# EAGLE design sklpf (EAGLE 7.7.0)
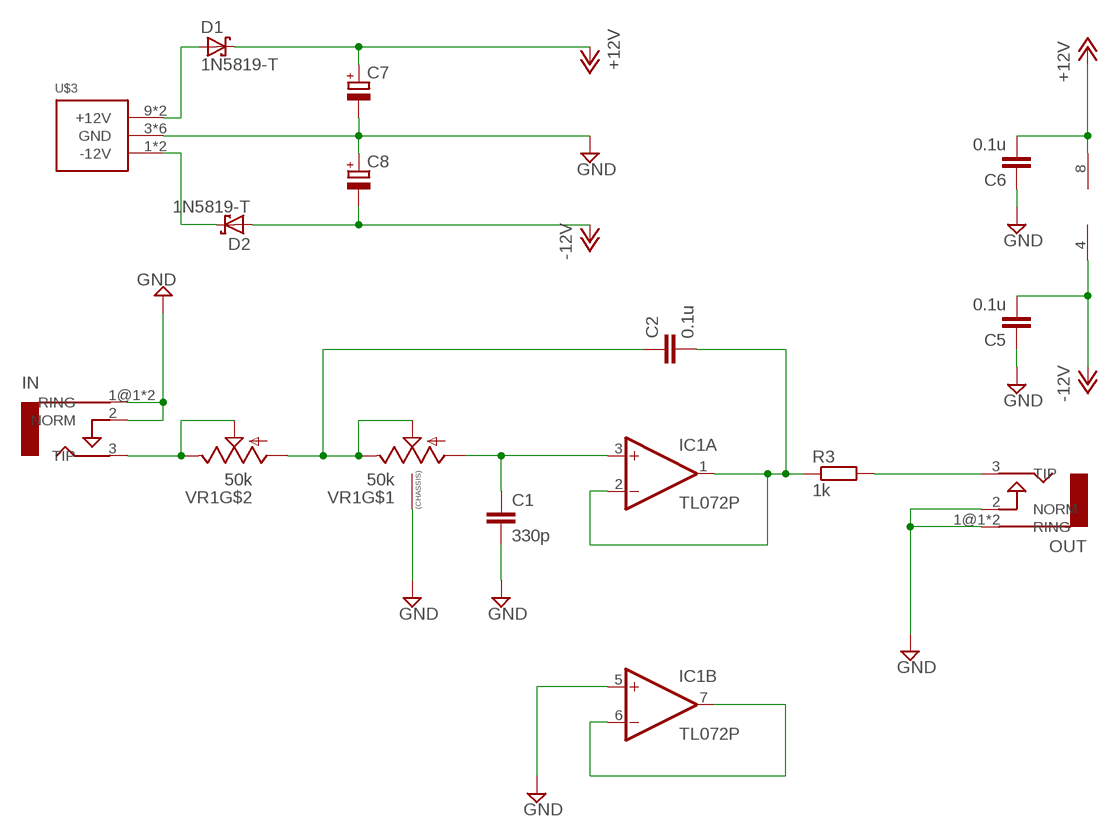
[diagram p0: schematic, sheet 1]

## Parts
C1  330p  C-EU025-025X050  [C025-025X050]
C2  0.1u  C-EU050-025X075  [C050-025X075]
C5  0.1u  C-EU025-025X050  [C025-025X050]
C6  0.1u  C-EU025-025X050  [C025-025X050]
C7  CPOL-EUE2,5-6E  [E2,5-6E]
C8  CPOL-EUE2,5-6E  [E2,5-6E]
D1  1N5819-T  [DO41-7.6]
D2  1N5819-T  [DO41-7.6]
IC1  TL072P  [DIL08]
IN  AUDIO-JACKERTHENVAR  [ERTHENVAR-JACK]
OUT  AUDIO-JACKERTHENVAR  [ERTHENVAR-JACK]
R3  1k  R-EU_0207/2V  [0207/2V]
U$3  POWER_SIMPLE10  [POWER_10]
VR1  50k  ALPHA-9MM-DUALPOT  [DUAL_9MM_SNAP-IN_POT]

## Nets
+12V: C6.2 C7.+ D1.C IC1.8(P:V+)
-12V: C5.2 C8.- D2.A IC1.4(P:V-)
GND: C1.2 C5.1 C6.1 C7.- C8.+ IC1.5(B:+IN) IN.1@1(RING) IN.1@2(RING) IN.2(NORM) OUT.1@1(RING) OUT.1@2(RING) OUT.2(NORM) U$3.3(GND) U$3.4(GND) U$3.5(GND) U$3.6(GND) U$3.7(GND) U$3.8(GND) VR1.CHASSIS1 VR1.CHASSIS2
N$1: C2.2 IC1.1(A:OUT) IC1.2(A:-IN) R3.1
N$2: C1.1 IC1.3(A:+IN) VR1.1(A)
N$3: C2.1 VR1.1B(A) VR1.2(S) VR1.3(E)
N$4: IN.3(TIP) VR1.2B(S) VR1.3B(E)
N$5: IC1.6(B:-IN) IC1.7(B:OUT)
N$6: OUT.3(TIP) R3.2
N$9: D2.C U$3.1(-12V) U$3.2(-12V)
N$10: D1.A U$3.9(+12V) U$3.10(+12V)

## Library data of the parts
C1 C2 C5 C6 = rcl:C-EU: CAPACITOR, European symbol
C7 C8 = rcl:CPOL-EU: POLARIZED CAPACITOR, European symbol
D1 D2 = diode:1N581*: 1.0A SCHOTTKY BARRIER RECTIFIER Source: http://www.diodes.com/datasheets/ds23001.pdf
IC1 = linear:TL072: OP AMP
IN OUT = erthenvar:AUDIO-JACK: Switching Mono 3.5mm Audio Jack from Erthenvar.
R3 = rcl:R-EU_: RESISTOR, European symbol
U$3 = eurorack:POWER_SIMPLE
VR1 = MusicThingModular:ALPHA-9MM-DUALPOT: 9mm vertical snap-in pot, Alpha / Panasonic style, with a connection to the metal chassis for grounding

## Board
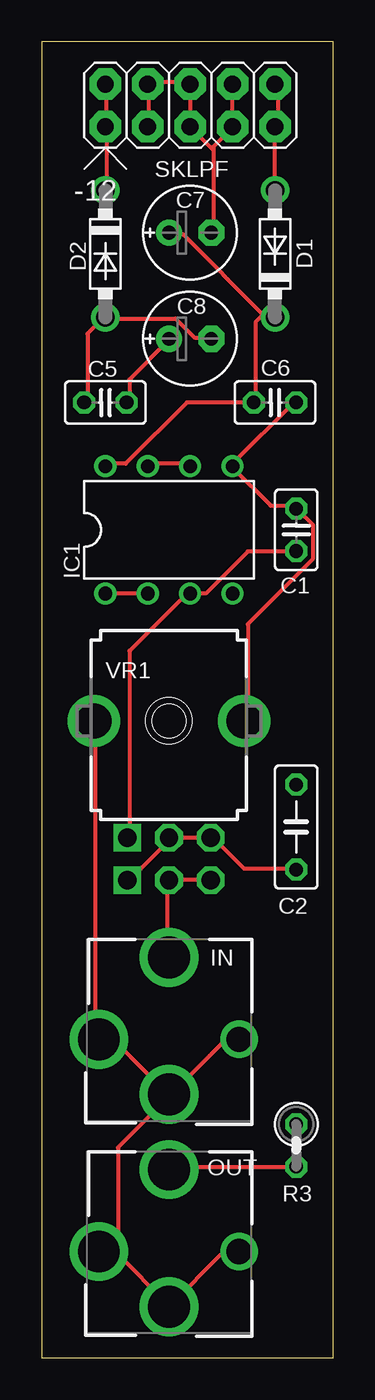
[diagram p1: board, top side]
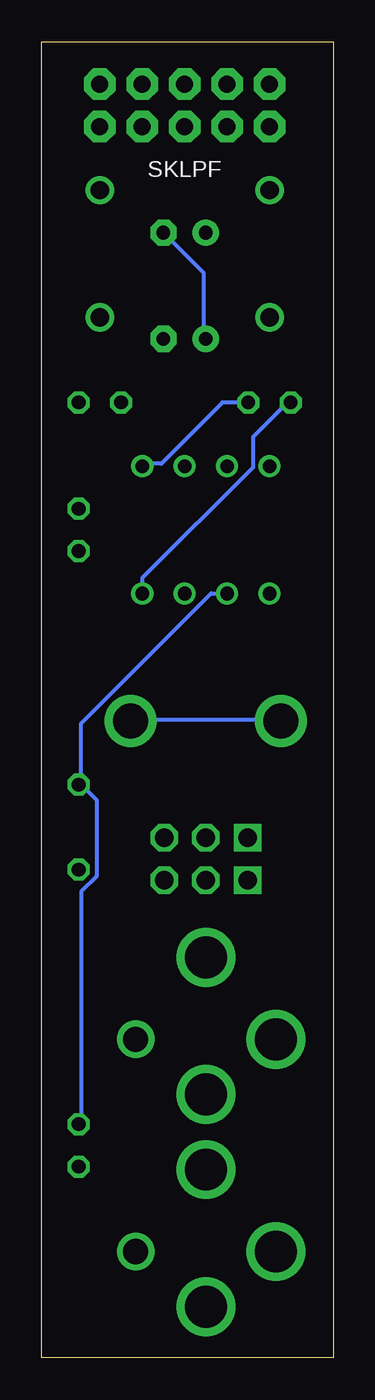
[diagram p2: board, bottom side, seen from below]

Size 17.45 x 78.73 mm. Coordinates in mm from the lower left corner, seen from the top.
Outline: 0,0 17.45,0 17.45,78.73 0,78.73 0,0
Copper layers (1*16): Top 0.035mm / dielectric 1.5mm / Bottom 0.035mm
Design rules "default": minimum track width 10mil, minimum drill 24mil, track to track 8mil, track to pad 8mil, pad to pad 8mil, via to via 8mil, smd to smd 8mil, copper to edge 40mil, drill to drill 8mil, minimum pad ring 10mil, minimum via ring 8mil, stop-mask expansion 4mil, vias tented up to drill 0mil, thermal gap 10mil

### Footprints (pad centres in the part's own frame; a part is rotated, then mirrored left to right if it is on the bottom)
C025-025X050 = drill 0.813 octagon: 1 -1.27,0; 2 1.27,0
C050-025X075 = drill 0.813 octagon: 1 -2.54,0; 2 2.54,0
E2,5-6E = drill 0.813 pad 1.575: + -1.27,0 | drill 0.813 pad 1.575 octagon: - 1.27,0
DO41-7.6 = drill 1.1 pad 1.7: A 3.81,0; C -3.81,0
DIL08 = drill 0.813 pad 1.27: 1 -3.81,-3.81; 2 -1.27,-3.81; 3 1.27,-3.81; 4 3.81,-3.81; 5 3.81,3.81; 6 1.27,3.81; 7 -1.27,3.81; 8 -3.81,3.81
ERTHENVAR-JACK = drill 2.5: 1@1 -4.2,0; 2 0,-3.3; 3 0,4.9 | drill 1.5: 1@2 4.2,0
0207/2V = drill 0.813 octagon: 1 -1.27,0; 2 1.27,0
POWER_10 = drill 1.016 pad 1.88 octagon: 1 -5.08,-1.27; 2 -5.08,1.27; 3 -2.54,-1.27; 4 -2.54,1.27; 5 0,-1.27; 6 0,1.27; 7 2.54,-1.27; 8 2.54,1.27; 9 5.08,-1.27; 10 5.08,1.27
DUAL_9MM_SNAP-IN_POT = drill 1.1 square: 1 -2.5,-7; 1B -2.5,-9.54 | drill 1.1 octagon: 2 0,-7; 2B 0,-9.54; 3 2.5,-7; 3B 2.5,-9.54 | drill 2.1 pad 2.54: CHASSIS1 -4.5,0; CHASSIS2 4.5,0

### Placement (x,y rotation side)
C1  15.24,49.53 90 top
C2  15.24,31.75 90 top
C5  3.81,57.15 180 top
C6  13.97,57.15 180 top
C7  8.89,67.31 0 top
C8  8.89,60.96 0 top
D1  13.97,66.04 90 top
D2  3.81,66.04 270 top
IC1  7.62,49.53 0 top
IN  7.62,19.05 0 top
OUT  7.62,6.35 0 top
R3  15.24,12.7 270 top
U$3  8.89,74.93 0 top
VR1  7.62,38.1 0 top

### Tracks (layer width: path | path; a pad name or v marks a point on that pad's centre or on a via)
+12V
  Top 0.254: IC1.8 3.89,53.49 5.03,53.49 8.69,57.15 C6.2 12.8,57.15 12.8,61.95 13.26,62.41 | 13.26,62.41 8.46,67.21 7.77,67.21 C7.+ | 13.26,62.41 13.95,62.41 D1.C 13.26,62.41
-12V
  Top 0.254: C5.2 2.74,57.15 2.74,61.27 3.66,62.18 D2.A 3.89,62.18 8,62.18 9.14,61.04 10.06,61.04 C8.-
  Bottom 0.254: IC1.4 11.43,46.63 4.8,53.26 4.8,55.09 2.74,57.15 C5.2
GND
  Top 0.254: OUT.1@2 11.66,6.17 10.74,6.17 7.77,3.2 OUT.2 7.54,3.2 4.57,6.17 | 4.57,6.17 3.43,6.17 OUT.1@1 4.57,6.17 | IN.1@2 11.66,18.97 10.97,18.97 7.77,15.77 IN.2 | IN.2 7.54,15.77 4.34,18.97 3.43,18.97 IN.1@1 3.2,19.2 3.2,37.95 VR1.CHASSIS1 | 4.57,6.17 4.57,12.57 7.54,15.54 IN.2 | C6.1 15.09,57.15 11.43,53.49 IC1.5 11.43,53.26 13.72,50.98 15.09,50.98 C1.2 15.32,50.75 16.23,49.84 16.23,47.78 12.34,43.89 12.34,38.18 VR1.CHASSIS2 | U$3.3 6.4,73.84 6.4,76.12 U$3.4 6.4,76.35 8.69,76.35 U$3.6 8.91,76.12 8.91,73.84 U$3.5 8.91,73.61 10.29,72.24 | C5.1 5.26,57.15 5.26,58.52 7.54,60.81 C8.+ | 10.29,72.24 10.29,72.47 11.43,73.61 U$3.7 U$3.8 | 10.29,72.24 10.29,67.44 C7.-
  Bottom 0.254: VR1.CHASSIS1 3.2,38.18 12.12,38.18 VR1.CHASSIS2 | C7.- 7.77,64.92 7.77,61.04 C8.+ | C5.1 6.63,57.15 10.29,53.49 11.43,53.49 IC1.5
N$1
  Top 0.254: IC1.2 IC1.1
  Bottom 0.254: 15.09,34.29 14.17,33.38 14.17,28.8 15.09,27.89 15.09,14.17 R3.1 | IC1.2 7.32,45.72 15.09,37.95 15.09,34.29 | 15.09,34.29 C2.2
N$2
  Top 0.254: C1.1 15.09,48.23 12.34,48.23 9.83,45.72 IC1.3 8.69,45.72 5.26,42.29 5.26,31.32 VR1.1
N$3
  Top 0.254: 7.77,31.09 5.26,28.57 VR1.1B | C2.1 15.09,29.26 12.12,29.26 10.29,31.09 VR1.3 10.06,31.09 7.77,31.09 | 7.77,31.09 VR1.2
N$4
  Top 0.254: VR1.3B 10.06,28.57 7.77,28.57 VR1.2B 7.54,28.35 7.54,24 IN.3
N$5
  Top 0.254: IC1.7 6.4,53.49 8.69,53.49 IC1.6
N$6
  Top 0.254: R3.2 7.77,11.43 OUT.3
N$9
  Top 0.254: D2.C 3.89,69.95 3.89,73.61 U$3.1 3.89,73.84 3.89,76.12 U$3.2
N$10
  Top 0.254: D1.A 13.95,69.95 13.95,73.61 U$3.9 14.17,73.84 14.17,76.12 U$3.10

### Text on the board
tNames: SKLPF
bNames: SKLPF